# EAGLE schematic RAC-power (EAGLE 9.4.2)
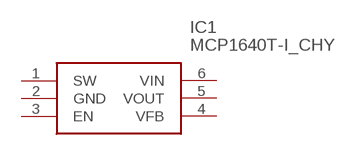
[diagram p0: schematic, sheet 1]

## Parts
IC1  MCP1640T-I_CHY  [SOT95P270X145-6N]
Unconnected: IC1.1(SW) IC1.3(EN) IC1.4(VFB) IC1.5(VOUT) IC1.6(VIN)

## Power pins joined to a net without a drawn wire
GND: IC1.2(GND)

## Library data of the parts
IC1 = RAC-Altimeter:MCP1640T-I_CHY: Microchip MCP1640T-I/CHY, Boost Converter, Step Up 0.35A Adjustable, 2 5.5 V, 575 kHz, 6-pin SOT-23 Source: Datasheet <https://componentsearchengine.com/Datasheets/1/MCP1640T-I_CHY.pdf>; DESCRIPTION: Microchip MCP1640T-I/CHY, Boost Converter, Step Up 0.35A Adjustable, 2 5.5 V, 575 kHz, 6-pin SOT-23; HEIGHT: 1.45mm; MANUFACTURER_NAME: Microchip; MANUFACTURER_PART_NUMBER: MCP1640T-I/CHY; MOUSER_PART_NUMBER: 579-MCP1640TI/CHY; MOUSER_PRICE-STOCK: https://www.mouser.com/Search/Refine.aspx?Keyword=579-MCP1640TI%2FCHY